# EAGLE board ws2812b-board (EAGLE 6.5.0), part 1 of 2
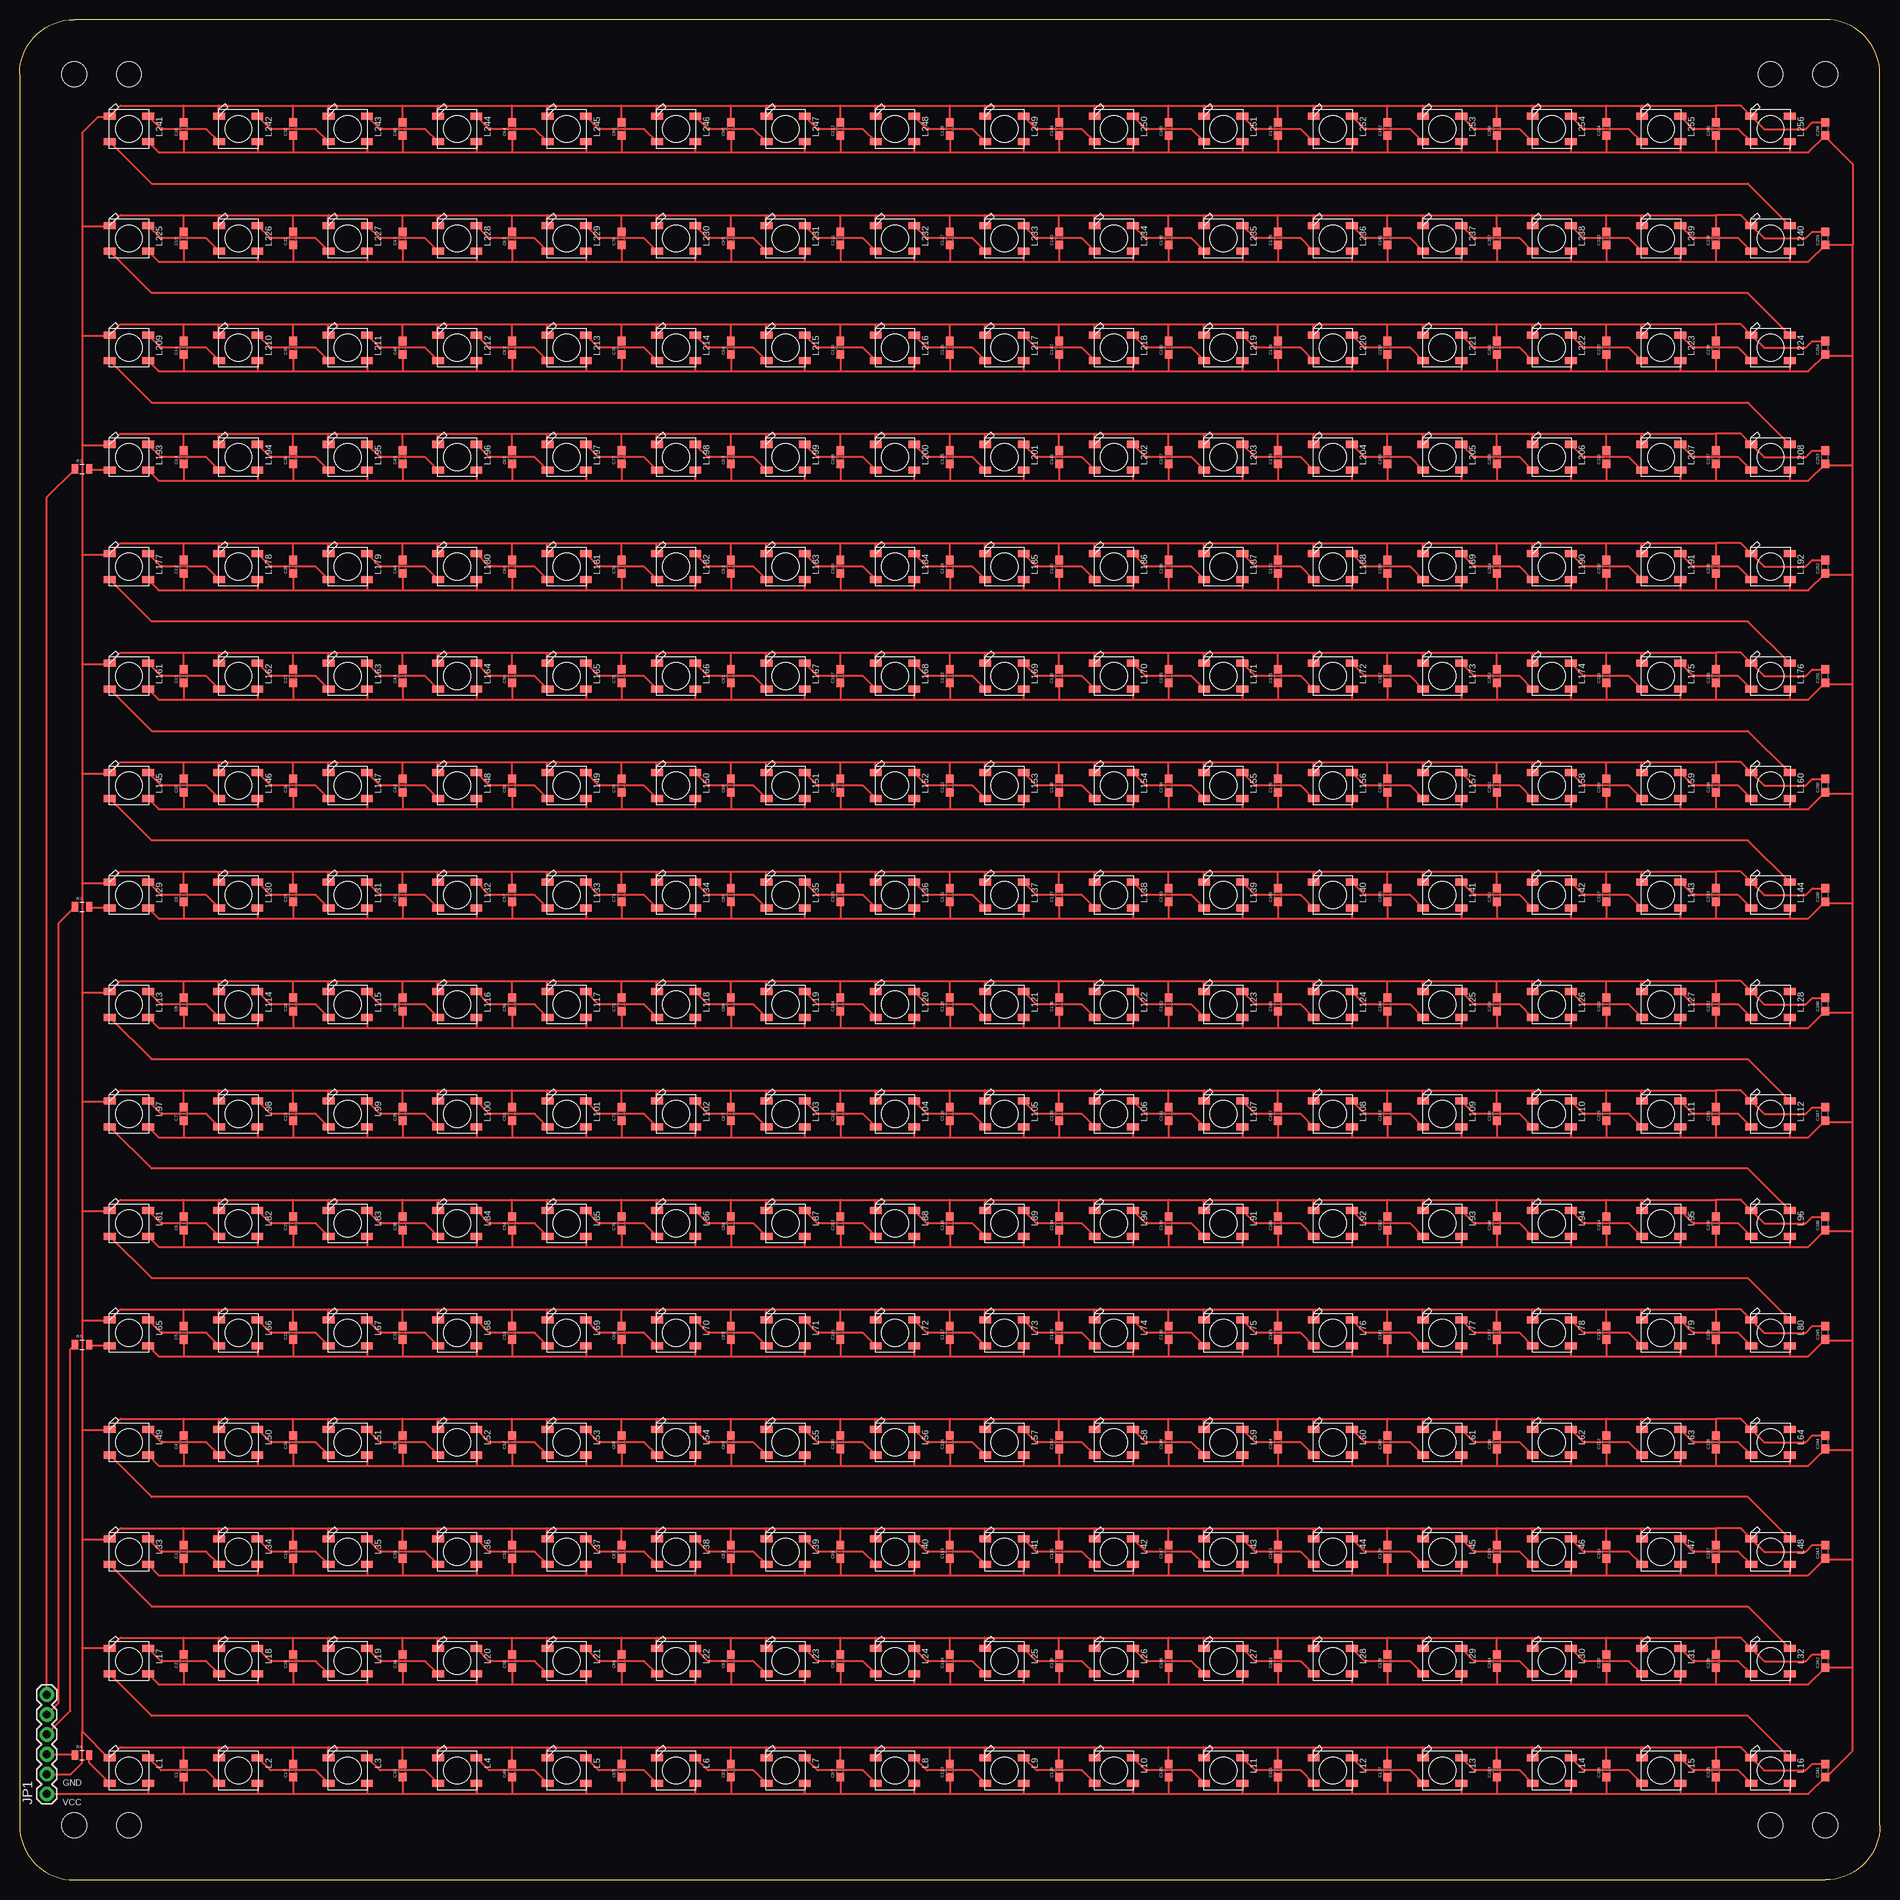
[diagram p2: board, top side]

Size 238 x 238 mm. Coordinates in mm from the lower left corner, seen from the top.
Outline: 7,0 231,0 arc90 238,7 238,231 arc90 231,238 7,238 arc90 0,231 0,7 arc90 7,0
Copper layers (1*16): Top 0.035mm / dielectric 1.5mm / Bottom 0.035mm
Design rules "DFRobot_Eagle_Rule_v0.4": minimum track width 6mil, minimum drill 12mil, track to track 6mil, track to pad 6mil, pad to pad 6mil, via to via 6mil, smd to smd 0mil, copper to edge 10mil, drill to drill 10mil, minimum pad ring 12mil, minimum via ring 8mil, stop-mask expansion 2mil, vias tented up to drill 25mil, thermal gap 10mil
Holes 3.2 mm at 7,231 231,231 231,7 7,7 14,231 224,231 224,7 14,7

## Footprints (pad centres in the part's own frame; a part is rotated, then mirrored left to right if it is on the bottom)
0603-CAP = smd 1.1 x 1: 1 -0.85,0; 2 0.85,0
1X06 = drill 1.016 pad 1.88: 1 0,0; 2 2.54,0; 3 5.08,0; 4 7.62,0; 5 10.16,0; 6 12.7,0
WS2812B = smd 1.5 x 0.9: 1-VDD 2.45,-1.65; 2-DOUT 2.45,1.65; 3-GND -2.45,1.65; 4-DIN -2.45,-1.65
0805 = smd 0.8 x 1.2: 1 -0.9,0; 2 0.9,0

## Placement (x,y rotation side)
C1  0.1uF  [0603-CAP]  21,14 90 top
C2  0.1uF  [0603-CAP]  21,28 90 top
C3  0.1uF  [0603-CAP]  21,42 90 top
C4  0.1uF  [0603-CAP]  21,56 90 top
C5  0.1uF  [0603-CAP]  21,70 90 top
C6  0.1uF  [0603-CAP]  21,84 90 top
C7  0.1uF  [0603-CAP]  21,98 90 top
C8  0.1uF  [0603-CAP]  21,112 90 top
C9  0.1uF  [0603-CAP]  21,126 90 top
C10  0.1uF  [0603-CAP]  21,140 90 top
C11  0.1uF  [0603-CAP]  21,154 90 top
C12  0.1uF  [0603-CAP]  21,168 90 top
C13  0.1uF  [0603-CAP]  21,182 90 top
C14  0.1uF  [0603-CAP]  21,196 90 top
C15  0.1uF  [0603-CAP]  21,210 90 top
C16  0.1uF  [0603-CAP]  21,224 90 top
C17  0.1uF  [0603-CAP]  35,14 90 top
C18  0.1uF  [0603-CAP]  35,28 90 top
C19  0.1uF  [0603-CAP]  35,42 90 top
C20  0.1uF  [0603-CAP]  35,56 90 top
C21  0.1uF  [0603-CAP]  35,70 90 top
C22  0.1uF  [0603-CAP]  35,84 90 top
C23  0.1uF  [0603-CAP]  35,98 90 top
C24  0.1uF  [0603-CAP]  35,112 90 top
C25  0.1uF  [0603-CAP]  35,126 90 top
C26  0.1uF  [0603-CAP]  35,140 90 top
C27  0.1uF  [0603-CAP]  35,154 90 top
C28  0.1uF  [0603-CAP]  35,168 90 top
C29  0.1uF  [0603-CAP]  35,182 90 top
C30  0.1uF  [0603-CAP]  35,196 90 top
C31  0.1uF  [0603-CAP]  35,210 90 top
C32  0.1uF  [0603-CAP]  35,224 90 top
C33  0.1uF  [0603-CAP]  49,14 90 top
C34  0.1uF  [0603-CAP]  49,28 90 top
C35  0.1uF  [0603-CAP]  49,42 90 top
C36  0.1uF  [0603-CAP]  49,56 90 top
C37  0.1uF  [0603-CAP]  49,70 90 top
C38  0.1uF  [0603-CAP]  49,84 90 top
C39  0.1uF  [0603-CAP]  49,98 90 top
C40  0.1uF  [0603-CAP]  49,112 90 top
C41  0.1uF  [0603-CAP]  49,126 90 top
C42  0.1uF  [0603-CAP]  49,140 90 top
C43  0.1uF  [0603-CAP]  49,154 90 top
C44  0.1uF  [0603-CAP]  49,168 90 top
C45  0.1uF  [0603-CAP]  49,182 90 top
C46  0.1uF  [0603-CAP]  49,196 90 top
C47  0.1uF  [0603-CAP]  49,210 90 top
C48  0.1uF  [0603-CAP]  49,224 90 top
C49  0.1uF  [0603-CAP]  63,14 90 top
C50  0.1uF  [0603-CAP]  63,28 90 top
C51  0.1uF  [0603-CAP]  63,42 90 top
C52  0.1uF  [0603-CAP]  63,56 90 top
C53  0.1uF  [0603-CAP]  63,70 90 top
C54  0.1uF  [0603-CAP]  63,84 90 top
C55  0.1uF  [0603-CAP]  63,98 90 top
C56  0.1uF  [0603-CAP]  63,112 90 top
C57  0.1uF  [0603-CAP]  63,126 90 top
C58  0.1uF  [0603-CAP]  63,140 90 top
C59  0.1uF  [0603-CAP]  63,154 90 top
C60  0.1uF  [0603-CAP]  63,168 90 top
C61  0.1uF  [0603-CAP]  63,182 90 top
C62  0.1uF  [0603-CAP]  63,196 90 top
C63  0.1uF  [0603-CAP]  63,210 90 top
C64  0.1uF  [0603-CAP]  63,224 90 top
C65  0.1uF  [0603-CAP]  77,14 90 top
C66  0.1uF  [0603-CAP]  77,28 90 top
C67  0.1uF  [0603-CAP]  77,42 90 top
C68  0.1uF  [0603-CAP]  77,56 90 top
C69  0.1uF  [0603-CAP]  77,70 90 top
C70  0.1uF  [0603-CAP]  77,84 90 top
C71  0.1uF  [0603-CAP]  77,98 90 top
C72  0.1uF  [0603-CAP]  77,112 90 top
C73  0.1uF  [0603-CAP]  77,126 90 top
C74  0.1uF  [0603-CAP]  77,140 90 top
C75  0.1uF  [0603-CAP]  77,154 90 top
C76  0.1uF  [0603-CAP]  77,168 90 top
C77  0.1uF  [0603-CAP]  77,182 90 top
C78  0.1uF  [0603-CAP]  77,196 90 top
C79  0.1uF  [0603-CAP]  77,210 90 top
C80  0.1uF  [0603-CAP]  77,224 90 top
C81  0.1uF  [0603-CAP]  91,14 90 top
C82  0.1uF  [0603-CAP]  91,28 90 top
C83  0.1uF  [0603-CAP]  91,42 90 top
C84  0.1uF  [0603-CAP]  91,56 90 top
C85  0.1uF  [0603-CAP]  91,70 90 top
C86  0.1uF  [0603-CAP]  91,84 90 top
C87  0.1uF  [0603-CAP]  91,98 90 top
C88  0.1uF  [0603-CAP]  91,112 90 top
C89  0.1uF  [0603-CAP]  91,126 90 top
C90  0.1uF  [0603-CAP]  91,140 90 top
C91  0.1uF  [0603-CAP]  91,154 90 top
C92  0.1uF  [0603-CAP]  91,168 90 top
C93  0.1uF  [0603-CAP]  91,182 90 top
C94  0.1uF  [0603-CAP]  91,196 90 top
C95  0.1uF  [0603-CAP]  91,210 90 top
C96  0.1uF  [0603-CAP]  91,224 90 top
C97  0.1uF  [0603-CAP]  105,14 90 top
C98  0.1uF  [0603-CAP]  105,28 90 top
C99  0.1uF  [0603-CAP]  105,42 90 top
C100  0.1uF  [0603-CAP]  105,56 90 top
C101  0.1uF  [0603-CAP]  105,70 90 top
C102  0.1uF  [0603-CAP]  105,84 90 top
C103  0.1uF  [0603-CAP]  105,98 90 top
C104  0.1uF  [0603-CAP]  105,112 90 top
C105  0.1uF  [0603-CAP]  105,126 90 top
C106  0.1uF  [0603-CAP]  105,140 90 top
C107  0.1uF  [0603-CAP]  105,154 90 top
C108  0.1uF  [0603-CAP]  105,168 90 top
C109  0.1uF  [0603-CAP]  105,182 90 top
C110  0.1uF  [0603-CAP]  105,196 90 top
C111  0.1uF  [0603-CAP]  105,210 90 top
C112  0.1uF  [0603-CAP]  105,224 90 top
C113  0.1uF  [0603-CAP]  119,14 90 top
C114  0.1uF  [0603-CAP]  119,28 90 top
C115  0.1uF  [0603-CAP]  119,42 90 top
C116  0.1uF  [0603-CAP]  119,56 90 top
C117  0.1uF  [0603-CAP]  119,70 90 top
C118  0.1uF  [0603-CAP]  119,84 90 top
C119  0.1uF  [0603-CAP]  119,98 90 top
C120  0.1uF  [0603-CAP]  119,112 90 top
C121  0.1uF  [0603-CAP]  119,126 90 top
C122  0.1uF  [0603-CAP]  119,140 90 top
C123  0.1uF  [0603-CAP]  119,154 90 top
C124  0.1uF  [0603-CAP]  119,168 90 top
C125  0.1uF  [0603-CAP]  119,182 90 top
C126  0.1uF  [0603-CAP]  119,196 90 top
C127  0.1uF  [0603-CAP]  119,210 90 top
C128  0.1uF  [0603-CAP]  119,224 90 top
C129  0.1uF  [0603-CAP]  133,14 90 top
C130  0.1uF  [0603-CAP]  133,28 90 top
C131  0.1uF  [0603-CAP]  133,42 90 top
C132  0.1uF  [0603-CAP]  133,56 90 top
C133  0.1uF  [0603-CAP]  133,70 90 top
C134  0.1uF  [0603-CAP]  133,84 90 top
C135  0.1uF  [0603-CAP]  133,98 90 top
C136  0.1uF  [0603-CAP]  133,112 90 top
C137  0.1uF  [0603-CAP]  133,126 90 top
C138  0.1uF  [0603-CAP]  133,140 90 top
C139  0.1uF  [0603-CAP]  133,154 90 top
C140  0.1uF  [0603-CAP]  133,168 90 top
C141  0.1uF  [0603-CAP]  133,182 90 top
C142  0.1uF  [0603-CAP]  133,196 90 top
C143  0.1uF  [0603-CAP]  133,210 90 top
C144  0.1uF  [0603-CAP]  133,224 90 top
C145  0.1uF  [0603-CAP]  147,14 90 top
C146  0.1uF  [0603-CAP]  147,28 90 top
C147  0.1uF  [0603-CAP]  147,42 90 top
C148  0.1uF  [0603-CAP]  147,56 90 top
C149  0.1uF  [0603-CAP]  147,70 90 top
C150  0.1uF  [0603-CAP]  147,84 90 top
C151  0.1uF  [0603-CAP]  147,98 90 top
C152  0.1uF  [0603-CAP]  147,112 90 top
C153  0.1uF  [0603-CAP]  147,126 90 top
C154  0.1uF  [0603-CAP]  147,140 90 top
C155  0.1uF  [0603-CAP]  147,154 90 top
C156  0.1uF  [0603-CAP]  147,168 90 top
C157  0.1uF  [0603-CAP]  147,182 90 top
C158  0.1uF  [0603-CAP]  147,196 90 top
C159  0.1uF  [0603-CAP]  147,210 90 top
C160  0.1uF  [0603-CAP]  147,224 90 top
C161  0.1uF  [0603-CAP]  161,14 90 top
C162  0.1uF  [0603-CAP]  161,28 90 top
C163  0.1uF  [0603-CAP]  161,42 90 top
C164  0.1uF  [0603-CAP]  161,56 90 top
C165  0.1uF  [0603-CAP]  161,70 90 top
C166  0.1uF  [0603-CAP]  161,84 90 top
C167  0.1uF  [0603-CAP]  161,98 90 top
C168  0.1uF  [0603-CAP]  161,112 90 top
C169  0.1uF  [0603-CAP]  161,126 90 top
C170  0.1uF  [0603-CAP]  161,140 90 top
C171  0.1uF  [0603-CAP]  161,154 90 top
C172  0.1uF  [0603-CAP]  161,168 90 top
C173  0.1uF  [0603-CAP]  161,182 90 top
C174  0.1uF  [0603-CAP]  161,196 90 top
C175  0.1uF  [0603-CAP]  161,210 90 top
C176  0.1uF  [0603-CAP]  161,224 90 top
C177  0.1uF  [0603-CAP]  175,14 90 top
C178  0.1uF  [0603-CAP]  175,28 90 top
C179  0.1uF  [0603-CAP]  175,42 90 top
C180  0.1uF  [0603-CAP]  175,56 90 top
C181  0.1uF  [0603-CAP]  175,70 90 top
C182  0.1uF  [0603-CAP]  175,84 90 top
C183  0.1uF  [0603-CAP]  175,98 90 top
C184  0.1uF  [0603-CAP]  175,112 90 top
C185  0.1uF  [0603-CAP]  175,126 90 top
C186  0.1uF  [0603-CAP]  175,140 90 top
C187  0.1uF  [0603-CAP]  175,154 90 top
C188  0.1uF  [0603-CAP]  175,168 90 top
C189  0.1uF  [0603-CAP]  175,182 90 top
C190  0.1uF  [0603-CAP]  175,196 90 top
C191  0.1uF  [0603-CAP]  175,210 90 top
C192  0.1uF  [0603-CAP]  175,224 90 top
C193  0.1uF  [0603-CAP]  189,14 90 top
C194  0.1uF  [0603-CAP]  189,28 90 top
C195  0.1uF  [0603-CAP]  189,42 90 top
C196  0.1uF  [0603-CAP]  189,56 90 top
C197  0.1uF  [0603-CAP]  189,70 90 top
C198  0.1uF  [0603-CAP]  189,84 90 top
C199  0.1uF  [0603-CAP]  189,98 90 top
C200  0.1uF  [0603-CAP]  189,112 90 top
C201  0.1uF  [0603-CAP]  189,126 90 top
C202  0.1uF  [0603-CAP]  189,140 90 top
C203  0.1uF  [0603-CAP]  189,154 90 top
C204  0.1uF  [0603-CAP]  189,168 90 top
C205  0.1uF  [0603-CAP]  189,182 90 top
C206  0.1uF  [0603-CAP]  189,196 90 top
C207  0.1uF  [0603-CAP]  189,210 90 top
C208  0.1uF  [0603-CAP]  189,224 90 top
C209  0.1uF  [0603-CAP]  203,14 90 top
C210  0.1uF  [0603-CAP]  203,28 90 top
C211  0.1uF  [0603-CAP]  203,42 90 top
C212  0.1uF  [0603-CAP]  203,56 90 top
C213  0.1uF  [0603-CAP]  203,70 90 top
C214  0.1uF  [0603-CAP]  203,84 90 top
C215  0.1uF  [0603-CAP]  203,98 90 top
C216  0.1uF  [0603-CAP]  203,112 90 top
C217  0.1uF  [0603-CAP]  203,126 90 top
C218  0.1uF  [0603-CAP]  203,140 90 top
C219  0.1uF  [0603-CAP]  203,154 90 top
C220  0.1uF  [0603-CAP]  203,168 90 top
C221  0.1uF  [0603-CAP]  203,182 90 top
C222  0.1uF  [0603-CAP]  203,196 90 top
C223  0.1uF  [0603-CAP]  203,210 90 top
C224  0.1uF  [0603-CAP]  203,224 90 top
C225  0.1uF  [0603-CAP]  217,14 90 top
C226  0.1uF  [0603-CAP]  217,28 90 top
C227  0.1uF  [0603-CAP]  217,42 90 top
C228  0.1uF  [0603-CAP]  217,56 90 top
C229  0.1uF  [0603-CAP]  217,70 90 top
C230  0.1uF  [0603-CAP]  217,84 90 top
C231  0.1uF  [0603-CAP]  217,98 90 top
C232  0.1uF  [0603-CAP]  217,112 90 top
C233  0.1uF  [0603-CAP]  217,126 90 top
C234  0.1uF  [0603-CAP]  217,140 90 top
C235  0.1uF  [0603-CAP]  217,154 90 top
C236  0.1uF  [0603-CAP]  217,168 90 top
C237  0.1uF  [0603-CAP]  217,182 90 top
C238  0.1uF  [0603-CAP]  217,196 90 top
C239  0.1uF  [0603-CAP]  217,210 90 top
C240  0.1uF  [0603-CAP]  217,224 90 top
C241  0.1uF  [0603-CAP]  231,14 90 top
C242  0.1uF  [0603-CAP]  231,28 90 top
C243  0.1uF  [0603-CAP]  231,42 90 top
C244  0.1uF  [0603-CAP]  231,56 90 top
C245  0.1uF  [0603-CAP]  231,70 90 top
C246  0.1uF  [0603-CAP]  231,84 90 top
C247  0.1uF  [0603-CAP]  231,98 90 top
C248  0.1uF  [0603-CAP]  231,112 90 top
C249  0.1uF  [0603-CAP]  231,126 90 top
C250  0.1uF  [0603-CAP]  231,140 90 top
C251  0.1uF  [0603-CAP]  231,154 90 top
C252  0.1uF  [0603-CAP]  231,168 90 top
C253  0.1uF  [0603-CAP]  231,182 90 top
C254  0.1uF  [0603-CAP]  231,196 90 top
C255  0.1uF  [0603-CAP]  231,210 90 top
C256  0.1uF  [0603-CAP]  231,224 90 top
JP1  [1X06]  3.5,11 90 top
L1  WS2812B  [WS2812B]  14,14 0 top
L2  WS2812B  [WS2812B]  28,14 0 top
L3  WS2812B  [WS2812B]  42,14 0 top
L4  WS2812B  [WS2812B]  56,14 0 top
L5  WS2812B  [WS2812B]  70,14 0 top
L6  WS2812B  [WS2812B]  84,14 0 top
L7  WS2812B  [WS2812B]  98,14 0 top
L8  WS2812B  [WS2812B]  112,14 0 top
L9  WS2812B  [WS2812B]  126,14 0 top
L10  WS2812B  [WS2812B]  140,14 0 top
L11  WS2812B  [WS2812B]  154,14 0 top
L12  WS2812B  [WS2812B]  168,14 0 top
L13  WS2812B  [WS2812B]  182,14 0 top
L14  WS2812B  [WS2812B]  196,14 0 top
L15  WS2812B  [WS2812B]  210,14 0 top
L16  WS2812B  [WS2812B]  224,14 0 top
L17  WS2812B  [WS2812B]  14,28 0 top
L18  WS2812B  [WS2812B]  28,28 0 top
L19  WS2812B  [WS2812B]  42,28 0 top
L20  WS2812B  [WS2812B]  56,28 0 top
L21  WS2812B  [WS2812B]  70,28 0 top
L22  WS2812B  [WS2812B]  84,28 0 top
L23  WS2812B  [WS2812B]  98,28 0 top
L24  WS2812B  [WS2812B]  112,28 0 top
L25  WS2812B  [WS2812B]  126,28 0 top
L26  WS2812B  [WS2812B]  140,28 0 top
L27  WS2812B  [WS2812B]  154,28 0 top
L28  WS2812B  [WS2812B]  168,28 0 top
L29  WS2812B  [WS2812B]  182,28 0 top
L30  WS2812B  [WS2812B]  196,28 0 top
L31  WS2812B  [WS2812B]  210,28 0 top
L32  WS2812B  [WS2812B]  224,28 0 top
L33  WS2812B  [WS2812B]  14,42 0 top
L34  WS2812B  [WS2812B]  28,42 0 top
L35  WS2812B  [WS2812B]  42,42 0 top
L36  WS2812B  [WS2812B]  56,42 0 top
L37  WS2812B  [WS2812B]  70,42 0 top
L38  WS2812B  [WS2812B]  84,42 0 top
L39  WS2812B  [WS2812B]  98,42 0 top
L40  WS2812B  [WS2812B]  112,42 0 top
L41  WS2812B  [WS2812B]  126,42 0 top
L42  WS2812B  [WS2812B]  140,42 0 top
L43  WS2812B  [WS2812B]  154,42 0 top
L44  WS2812B  [WS2812B]  168,42 0 top
L45  WS2812B  [WS2812B]  182,42 0 top
L46  WS2812B  [WS2812B]  196,42 0 top
L47  WS2812B  [WS2812B]  210,42 0 top
L48  WS2812B  [WS2812B]  224,42 0 top
L49  WS2812B  [WS2812B]  14,56 0 top
L50  WS2812B  [WS2812B]  28,56 0 top
L51  WS2812B  [WS2812B]  42,56 0 top
L52  WS2812B  [WS2812B]  56,56 0 top
L53  WS2812B  [WS2812B]  70,56 0 top
L54  WS2812B  [WS2812B]  84,56 0 top
L55  WS2812B  [WS2812B]  98,56 0 top
L56  WS2812B  [WS2812B]  112,56 0 top
L57  WS2812B  [WS2812B]  126,56 0 top
L58  WS2812B  [WS2812B]  140,56 0 top
L59  WS2812B  [WS2812B]  154,56 0 top
L60  WS2812B  [WS2812B]  168,56 0 top
L61  WS2812B  [WS2812B]  182,56 0 top
L62  WS2812B  [WS2812B]  196,56 0 top
L63  WS2812B  [WS2812B]  210,56 0 top
L64  WS2812B  [WS2812B]  224,56 0 top
L65  WS2812B  [WS2812B]  14,70 0 top
L66  WS2812B  [WS2812B]  28,70 0 top
L67  WS2812B  [WS2812B]  42,70 0 top
L68  WS2812B  [WS2812B]  56,70 0 top
L69  WS2812B  [WS2812B]  70,70 0 top
L70  WS2812B  [WS2812B]  84,70 0 top
L71  WS2812B  [WS2812B]  98,70 0 top
L72  WS2812B  [WS2812B]  112,70 0 top
L73  WS2812B  [WS2812B]  126,70 0 top
L74  WS2812B  [WS2812B]  140,70 0 top
L75  WS2812B  [WS2812B]  154,70 0 top
L76  WS2812B  [WS2812B]  168,70 0 top
L77  WS2812B  [WS2812B]  182,70 0 top
L78  WS2812B  [WS2812B]  196,70 0 top
L79  WS2812B  [WS2812B]  210,70 0 top
L80  WS2812B  [WS2812B]  224,70 0 top
L81  WS2812B  [WS2812B]  14,84 0 top
L82  WS2812B  [WS2812B]  28,84 0 top
L83  WS2812B  [WS2812B]  42,84 0 top
L84  WS2812B  [WS2812B]  56,84 0 top
L85  WS2812B  [WS2812B]  70,84 0 top
L86  WS2812B  [WS2812B]  84,84 0 top
L87  WS2812B  [WS2812B]  98,84 0 top
L88  WS2812B  [WS2812B]  112,84 0 top
L89  WS2812B  [WS2812B]  126,84 0 top
L90  WS2812B  [WS2812B]  140,84 0 top
L91  WS2812B  [WS2812B]  154,84 0 top
L92  WS2812B  [WS2812B]  168,84 0 top
L93  WS2812B  [WS2812B]  182,84 0 top
L94  WS2812B  [WS2812B]  196,84 0 top
L95  WS2812B  [WS2812B]  210,84 0 top
L96  WS2812B  [WS2812B]  224,84 0 top
L97  WS2812B  [WS2812B]  14,98 0 top
L98  WS2812B  [WS2812B]  28,98 0 top
L99  WS2812B  [WS2812B]  42,98 0 top
L100  WS2812B  [WS2812B]  56,98 0 top
L101  WS2812B  [WS2812B]  70,98 0 top
L102  WS2812B  [WS2812B]  84,98 0 top
L103  WS2812B  [WS2812B]  98,98 0 top
L104  WS2812B  [WS2812B]  112,98 0 top
L105  WS2812B  [WS2812B]  126,98 0 top
L106  WS2812B  [WS2812B]  140,98 0 top
L107  WS2812B  [WS2812B]  154,98 0 top
L108  WS2812B  [WS2812B]  168,98 0 top
L109  WS2812B  [WS2812B]  182,98 0 top
L110  WS2812B  [WS2812B]  196,98 0 top
L111  WS2812B  [WS2812B]  210,98 0 top
L112  WS2812B  [WS2812B]  224,98 0 top
L113  WS2812B  [WS2812B]  14,112 0 top
L114  WS2812B  [WS2812B]  28,112 0 top
L115  WS2812B  [WS2812B]  42,112 0 top
L116  WS2812B  [WS2812B]  56,112 0 top
L117  WS2812B  [WS2812B]  70,112 0 top
L118  WS2812B  [WS2812B]  84,112 0 top
L119  WS2812B  [WS2812B]  98,112 0 top
L120  WS2812B  [WS2812B]  112,112 0 top
L121  WS2812B  [WS2812B]  126,112 0 top
L122  WS2812B  [WS2812B]  140,112 0 top
L123  WS2812B  [WS2812B]  154,112 0 top
L124  WS2812B  [WS2812B]  168,112 0 top
L125  WS2812B  [WS2812B]  182,112 0 top
L126  WS2812B  [WS2812B]  196,112 0 top
L127  WS2812B  [WS2812B]  210,112 0 top
L128  WS2812B  [WS2812B]  224,112 0 top
L129  WS2812B  [WS2812B]  14,126 0 top
L130  WS2812B  [WS2812B]  28,126 0 top
L131  WS2812B  [WS2812B]  42,126 0 top
L132  WS2812B  [WS2812B]  56,126 0 top
L133  WS2812B  [WS2812B]  70,126 0 top
L134  WS2812B  [WS2812B]  84,126 0 top
L135  WS2812B  [WS2812B]  98,126 0 top
L136  WS2812B  [WS2812B]  112,126 0 top
L137  WS2812B  [WS2812B]  126,126 0 top
L138  WS2812B  [WS2812B]  140,126 0 top
L139  WS2812B  [WS2812B]  154,126 0 top
L140  WS2812B  [WS2812B]  168,126 0 top
L141  WS2812B  [WS2812B]  182,126 0 top
L142  WS2812B  [WS2812B]  196,126 0 top
L143  WS2812B  [WS2812B]  210,126 0 top
L144  WS2812B  [WS2812B]  224,126 0 top
L145  WS2812B  [WS2812B]  14,140 0 top
L146  WS2812B  [WS2812B]  28,140 0 top
L147  WS2812B  [WS2812B]  42,140 0 top
L148  WS2812B  [WS2812B]  56,140 0 top
L149  WS2812B  [WS2812B]  70,140 0 top
L150  WS2812B  [WS2812B]  84,140 0 top
L151  WS2812B  [WS2812B]  98,140 0 top
L152  WS2812B  [WS2812B]  112,140 0 top
L153  WS2812B  [WS2812B]  126,140 0 top
L154  WS2812B  [WS2812B]  140,140 0 top
L155  WS2812B  [WS2812B]  154,140 0 top
L156  WS2812B  [WS2812B]  168,140 0 top
L157  WS2812B  [WS2812B]  182,140 0 top
L158  WS2812B  [WS2812B]  196,140 0 top
L159  WS2812B  [WS2812B]  210,140 0 top
L160  WS2812B  [WS2812B]  224,140 0 top
L161  WS2812B  [WS2812B]  14,154 0 top
L162  WS2812B  [WS2812B]  28,154 0 top
L163  WS2812B  [WS2812B]  42,154 0 top
L164  WS2812B  [WS2812B]  56,154 0 top
L165  WS2812B  [WS2812B]  70,154 0 top
L166  WS2812B  [WS2812B]  84,154 0 top
L167  WS2812B  [WS2812B]  98,154 0 top
L168  WS2812B  [WS2812B]  112,154 0 top
L169  WS2812B  [WS2812B]  126,154 0 top
L170  WS2812B  [WS2812B]  140,154 0 top
L171  WS2812B  [WS2812B]  154,154 0 top
L172  WS2812B  [WS2812B]  168,154 0 top
L173  WS2812B  [WS2812B]  182,154 0 top
L174  WS2812B  [WS2812B]  196,154 0 top
L175  WS2812B  [WS2812B]  210,154 0 top
L176  WS2812B  [WS2812B]  224,154 0 top
L177  WS2812B  [WS2812B]  14,168 0 top
L178  WS2812B  [WS2812B]  28,168 0 top
L179  WS2812B  [WS2812B]  42,168 0 top
L180  WS2812B  [WS2812B]  56,168 0 top
L181  WS2812B  [WS2812B]  70,168 0 top
L182  WS2812B  [WS2812B]  84,168 0 top
L183  WS2812B  [WS2812B]  98,168 0 top
L184  WS2812B  [WS2812B]  112,168 0 top
L185  WS2812B  [WS2812B]  126,168 0 top
L186  WS2812B  [WS2812B]  140,168 0 top
L187  WS2812B  [WS2812B]  154,168 0 top
L188  WS2812B  [WS2812B]  168,168 0 top
L189  WS2812B  [WS2812B]  182,168 0 top
L190  WS2812B  [WS2812B]  196,168 0 top
L191  WS2812B  [WS2812B]  210,168 0 top
L192  WS2812B  [WS2812B]  224,168 0 top
L193  WS2812B  [WS2812B]  14,182 0 top
L194  WS2812B  [WS2812B]  28,182 0 top
L195  WS2812B  [WS2812B]  42,182 0 top
L196  WS2812B  [WS2812B]  56,182 0 top
L197  WS2812B  [WS2812B]  70,182 0 top
L198  WS2812B  [WS2812B]  84,182 0 top
L199  WS2812B  [WS2812B]  98,182 0 top
L200  WS2812B  [WS2812B]  112,182 0 top
L201  WS2812B  [WS2812B]  126,182 0 top
L202  WS2812B  [WS2812B]  140,182 0 top
L203  WS2812B  [WS2812B]  154,182 0 top
L204  WS2812B  [WS2812B]  168,182 0 top
L205  WS2812B  [WS2812B]  182,182 0 top
L206  WS2812B  [WS2812B]  196,182 0 top
L207  WS2812B  [WS2812B]  210,182 0 top
L208  WS2812B  [WS2812B]  224,182 0 top
L209  WS2812B  [WS2812B]  14,196 0 top
L210  WS2812B  [WS2812B]  28,196 0 top
L211  WS2812B  [WS2812B]  42,196 0 top
L212  WS2812B  [WS2812B]  56,196 0 top
L213  WS2812B  [WS2812B]  70,196 0 top
L214  WS2812B  [WS2812B]  84,196 0 top
L215  WS2812B  [WS2812B]  98,196 0 top
L216  WS2812B  [WS2812B]  112,196 0 top
L217  WS2812B  [WS2812B]  126,196 0 top
L218  WS2812B  [WS2812B]  140,196 0 top
L219  WS2812B  [WS2812B]  154,196 0 top
L220  WS2812B  [WS2812B]  168,196 0 top
L221  WS2812B  [WS2812B]  182,196 0 top
L222  WS2812B  [WS2812B]  196,196 0 top
L223  WS2812B  [WS2812B]  210,196 0 top
L224  WS2812B  [WS2812B]  224,196 0 top
L225  WS2812B  [WS2812B]  14,210 0 top
L226  WS2812B  [WS2812B]  28,210 0 top
L227  WS2812B  [WS2812B]  42,210 0 top
L228  WS2812B  [WS2812B]  56,210 0 top
L229  WS2812B  [WS2812B]  70,210 0 top
L230  WS2812B  [WS2812B]  84,210 0 top
L231  WS2812B  [WS2812B]  98,210 0 top
L232  WS2812B  [WS2812B]  112,210 0 top
L233  WS2812B  [WS2812B]  126,210 0 top
L234  WS2812B  [WS2812B]  140,210 0 top
L235  WS2812B  [WS2812B]  154,210 0 top
L236  WS2812B  [WS2812B]  168,210 0 top
L237  WS2812B  [WS2812B]  182,210 0 top
L238  WS2812B  [WS2812B]  196,210 0 top
L239  WS2812B  [WS2812B]  210,210 0 top
L240  WS2812B  [WS2812B]  224,210 0 top
L241  WS2812B  [WS2812B]  14,224 0 top
L242  WS2812B  [WS2812B]  28,224 0 top
L243  WS2812B  [WS2812B]  42,224 0 top
L244  WS2812B  [WS2812B]  56,224 0 top
L245  WS2812B  [WS2812B]  70,224 0 top
L246  WS2812B  [WS2812B]  84,224 0 top
L247  WS2812B  [WS2812B]  98,224 0 top
L248  WS2812B  [WS2812B]  112,224 0 top
L249  WS2812B  [WS2812B]  126,224 0 top
L250  WS2812B  [WS2812B]  140,224 0 top
L251  WS2812B  [WS2812B]  154,224 0 top
L252  WS2812B  [WS2812B]  168,224 0 top
L253  WS2812B  [WS2812B]  182,224 0 top
L254  WS2812B  [WS2812B]  196,224 0 top
L255  WS2812B  [WS2812B]  210,224 0 top
L256  WS2812B  [WS2812B]  224,224 0 top
R2  [0805]  8,180.5 0 top
R3  [0805]  8,124.5 0 top
R4  [0805]  8,16 0 top
R5  [0805]  8,68.5 0 top

## Tracks (layer width: path | path; a pad name or v marks a point on that pad's centre or on a via)
GND
  Top 0.254: 11.95,16.05 L1.3-GND 11.55,15.45 | 11.95,16.05 12.9,17 21,17 | L81.3-GND 11.95,86.05 | 11.95,86.05 12.9,87 21,87 | L129.3-GND 11.95,128.05 | 11.95,128.05 12.9,129 21,129 | 21,31 12.9,31 L17.3-GND 8,29.65 | 21,45 12.9,45 L33.3-GND 11.5,43.65 11.5,43.5 8,43.5 | 21,59 12.9,59 L49.3-GND 11.5,57.65 11.5,57.5 8,57.5 | 21,73 12.9,73 L65.3-GND 11.5,71.65 11.5,71.5 8,71.5 | 21,101 12.9,101 L97.3-GND 11.5,99.65 11.5,99.5 8,99.5 | 21,115 12.9,115 L113.3-GND 11.5,113.65 11.5,113.5 8,113.5 | 21,143 12.9,143 L145.3-GND 11.5,141.65 11.5,141.5 8,141.5 | 21,157 12.9,157 L161.3-GND 11.5,155.65 11.5,155.5 8,155.5 | 21,171 12.9,171 L177.3-GND 11.5,169.65 11.5,169.5 8,169.5 | 21,185 12.9,185 L193.3-GND 11.5,183.65 11.5,183.5 8,183.5 | 21,199 12.9,199 L209.3-GND 11.5,197.65 11.5,197.5 8,197.5 | 21,213 12.9,213 L225.3-GND 11.5,211.65 11.5,211.5 8,211.5 | 21,227 12.9,227 L241.3-GND 11.5,225.65 11.5,225.5 10,225.5 8,223.5 8,211.5 | 21,17 25.5,17 | 21,31 25.5,31 | 21,45 25.5,45 | 21,59 25.5,59 | 21,73 25.5,73 | 21,87 25.5,87 | 21,101 25.5,101 | 21,115 25.5,115 | 21,129 25.5,129 | 21,143 25.5,143 | 21,157 25.5,157 | 21,171 25.5,171 | 21,185 25.5,185 | 21,199 25.5,199 | 21,213 25.5,213 | 21,227 25.5,227 | 25.5,17 35,17 | 25.5,31 35,31 | 25.5,45 35,45 | 25.5,59 35,59 | 25.5,73 35,73 | 25.5,87 35,87 | 25.5,101 35,101 | 25.5,115 35,115 | 25.5,129 35,129 | 25.5,143 35,143 | 25.5,157 35,157 | 25.5,171 35,171 | 25.5,185 35,185 | 25.5,199 35,199 | 25.5,213 35,213 | 25.5,227 35,227 | 35,17 39.5,17 | 35,31 39.5,31 | 35,45 39.5,45 | 35,59 39.5,59 | 35,73 39.5,73 | 35,87 39.5,87 | 35,101 39.5,101 | 35,115 39.5,115 | 35,129 39.5,129 | 35,143 39.5,143 | 35,157 39.5,157 | 35,171 39.5,171 | 35,185 39.5,185
  Top 0.254: 35,199 39.5,199 | 35,213 39.5,213 | 35,227 39.5,227 | 39.5,17 49,17 | 39.5,31 49,31 | 39.5,45 49,45 | 39.5,59 49,59 | 39.5,73 49,73 | 39.5,87 49,87 | 39.5,101 49,101 | 39.5,115 49,115 | 39.5,129 49,129 | 39.5,143 49,143 | 39.5,157 49,157 | 39.5,171 49,171 | 39.5,185 49,185 | 39.5,199 49,199 | 39.5,213 49,213 | 39.5,227 49,227 | 49,17 53.5,17 | 49,31 53.5,31 | 49,45 53.5,45 | 49,59 53.5,59 | 49,73 53.5,73 | 49,87 53.5,87 | 49,101 53.5,101 | 49,115 53.5,115 | 49,129 53.5,129 | 49,143 53.5,143 | 49,157 53.5,157 | 49,171 53.5,171 | 49,185 53.5,185 | 49,199 53.5,199 | 49,213 53.5,213 | 49,227 53.5,227 | 53.5,17 63,17 | 53.5,31 63,31 | 53.5,45 63,45 | 53.5,59 63,59 | 53.5,73 63,73 | 53.5,87 63,87 | 53.5,101 63,101 | 53.5,115 63,115 | 53.5,129 63,129 | 53.5,143 63,143 | 53.5,157 63,157 | 53.5,171 63,171 | 53.5,185 63,185 | 53.5,199 63,199 | 53.5,213 63,213 | 53.5,227 63,227 | 63,17 67.5,17 | 63,31 67.5,31 | 63,45 67.5,45 | 63,59 67.5,59 | 63,73 67.5,73 | 63,87 67.5,87 | 63,101 67.5,101 | 63,115 67.5,115 | 63,129 67.5,129 | 63,143 67.5,143 | 63,157 67.5,157 | 63,171 67.5,171 | 63,185 67.5,185 | 63,199 67.5,199 | 63,213 67.5,213 | 63,227 67.5,227 | 67.5,17 77,17 | 67.5,31 77,31 | 67.5,45 77,45 | 67.5,59 77,59 | 67.5,73 77,73 | 67.5,87 77,87 | 67.5,101 77,101 | 67.5,115 77,115 | 67.5,129 77,129 | 67.5,143 77,143 | 67.5,157 77,157 | 67.5,171 77,171 | 67.5,185 77,185 | 67.5,199 77,199 | 67.5,213 77,213 | 67.5,227 77,227 | 77,17 81.5,17 | 77,31 81.5,31 | 77,45 81.5,45 | 77,59 81.5,59 | 77,73 81.5,73 | 77,87 81.5,87 | 77,101 81.5,101 | 77,115 81.5,115 | 77,129 81.5,129 | 77,143 81.5,143 | 77,157 81.5,157 | 77,171 81.5,171 | 77,185 81.5,185 | 77,199 81.5,199 | 77,213 81.5,213 | 77,227 81.5,227 | 81.5,17 91,17 | 81.5,31 91,31 | 81.5,45 91,45 | 81.5,59 91,59 | 81.5,73 91,73 | 81.5,87 91,87 | 81.5,101 91,101
  Top 0.254: 81.5,115 91,115 | 81.5,129 91,129 | 81.5,143 91,143 | 81.5,157 91,157 | 81.5,171 91,171 | 81.5,185 91,185 | 81.5,199 91,199 | 81.5,213 91,213 | 81.5,227 91,227 | 91,17 95.5,17 | 91,31 95.5,31 | 91,45 95.5,45 | 91,59 95.5,59 | 91,73 95.5,73 | 91,87 95.5,87 | 91,101 95.5,101 | 91,115 95.5,115 | 91,129 95.5,129 | 91,143 95.5,143 | 91,157 95.5,157 | 91,171 95.5,171 | 91,185 95.5,185 | 91,199 95.5,199 | 91,213 95.5,213 | 91,227 95.5,227 | 95.5,17 105,17 | 95.5,31 105,31 | 95.5,45 105,45 | 95.5,59 105,59 | 95.5,73 105,73 | 95.5,87 105,87 | 95.5,101 105,101 | 95.5,115 105,115 | 95.5,129 105,129 | 95.5,143 105,143 | 95.5,157 105,157 | 95.5,171 105,171 | 95.5,185 105,185 | 95.5,199 105,199 | 95.5,213 105,213 | 95.5,227 105,227 | 105,17 109.5,17 | 105,31 109.5,31 | 105,45 109.5,45 | 105,59 109.5,59 | 105,73 109.5,73 | 105,87 109.5,87 | 105,101 109.5,101 | 105,115 109.5,115 | 105,129 109.5,129 | 105,143 109.5,143 | 105,157 109.5,157 | 105,171 109.5,171 | 105,185 109.5,185 | 105,199 109.5,199 | 105,213 109.5,213 | 105,227 109.5,227 | 109.5,17 119,17 | 109.5,31 119,31 | 109.5,45 119,45 | 109.5,59 119,59 | 109.5,73 119,73 | 109.5,87 119,87 | 109.5,101 119,101 | 109.5,115 119,115 | 109.5,129 119,129 | 109.5,143 119,143 | 109.5,157 119,157 | 109.5,171 119,171 | 109.5,185 119,185 | 109.5,199 119,199 | 109.5,213 119,213 | 109.5,227 119,227 | 119,17 123.5,17 | 119,31 123.5,31 | 119,45 123.5,45 | 119,59 123.5,59 | 119,73 123.5,73 | 119,87 123.5,87 | 119,101 123.5,101 | 119,115 123.5,115 | 119,129 123.5,129 | 119,143 123.5,143 | 119,157 123.5,157 | 119,171 123.5,171 | 119,185 123.5,185 | 119,199 123.5,199 | 119,213 123.5,213 | 119,227 123.5,227 | 123.5,17 133,17 | 133,17 137.5,17 | 123.5,31 133,31 | 133,31 137.5,31 | 123.5,45 133,45 | 133,45 137.5,45 | 123.5,59 133,59 | 133,59 137.5,59
  Top 0.254: 123.5,73 133,73 | 133,73 137.5,73 | 123.5,87 133,87 | 133,87 137.5,87 | 123.5,101 133,101 | 133,101 137.5,101 | 123.5,115 133,115 | 133,115 137.5,115 | 123.5,129 133,129 | 133,129 137.5,129 | 123.5,143 133,143 | 133,143 137.5,143 | 123.5,157 133,157 | 133,157 137.5,157 | 123.5,171 133,171 | 133,171 137.5,171 | 123.5,185 133,185 | 133,185 137.5,185 | 123.5,199 133,199 | 133,199 137.5,199 | 123.5,213 133,213 | 133,213 137.5,213 | 123.5,227 133,227 | 133,227 137.5,227 | 137.5,17 147,17 | 137.5,31 147,31 | 137.5,45 147,45 | 137.5,59 147,59 | 137.5,73 147,73 | 137.5,87 147,87 | 137.5,101 147,101 | 137.5,115 147,115 | 137.5,129 147,129 | 137.5,143 147,143 | 137.5,157 147,157 | 137.5,171 147,171 | 137.5,185 147,185 | 137.5,199 147,199 | 137.5,213 147,213 | 137.5,227 147,227 | 147,17 151.5,17 | 147,31 151.5,31 | 147,45 151.5,45 | 147,59 151.5,59 | 147,73 151.5,73 | 147,87 151.5,87 | 147,101 151.5,101 | 147,115 151.5,115 | 147,129 151.5,129 | 147,143 151.5,143 | 147,157 151.5,157 | 147,171 151.5,171 | 147,185 151.5,185 | 147,199 151.5,199 | 147,213 151.5,213 | 147,227 151.5,227 | 151.5,17 161,17 | 151.5,31 161,31 | 151.5,45 161,45 | 151.5,59 161,59 | 151.5,73 161,73 | 151.5,87 161,87 | 151.5,101 161,101 | 151.5,115 161,115 | 151.5,129 161,129 | 151.5,143 161,143 | 151.5,157 161,157 | 151.5,171 161,171 | 151.5,185 161,185 | 151.5,199 161,199 | 151.5,213 161,213 | 151.5,227 161,227 | 161,17 165.5,17 | 161,31 165.5,31 | 161,45 165.5,45 | 161,59 165.5,59 | 161,73 165.5,73 | 161,87 165.5,87 | 161,101 165.5,101 | 161,115 165.5,115 | 161,129 165.5,129 | 161,143 165.5,143 | 161,157 165.5,157 | 161,171 165.5,171 | 161,185 165.5,185 | 161,199 165.5,199 | 161,213 165.5,213 | 161,227 165.5,227 | 165.5,17 175,17 | 165.5,31 175,31 | 165.5,45 175,45 | 165.5,59 175,59 | 165.5,73 175,73
  Top 0.254: 165.5,87 175,87 | 165.5,101 175,101 | 165.5,115 175,115 | 165.5,129 175,129 | 165.5,143 175,143 | 165.5,157 175,157 | 165.5,171 175,171 | 165.5,185 175,185 | 165.5,199 175,199 | 165.5,213 175,213 | 165.5,227 175,227 | 175,17 179.5,17 | 175,31 179.5,31 | 175,45 179.5,45 | 175,59 179.5,59 | 175,73 179.5,73 | 175,87 179.5,87 | 175,101 179.5,101 | 175,115 179.5,115 | 175,129 179.5,129 | 175,143 179.5,143 | 175,157 179.5,157 | 175,171 179.5,171 | 175,185 179.5,185 | 175,199 179.5,199 | 175,213 179.5,213 | 175,227 179.5,227 | 179.5,17 189,17 | 179.5,31 189,31 | 179.5,45 189,45 | 179.5,59 189,59 | 179.5,73 189,73 | 179.5,87 189,87 | 179.5,101 189,101 | 179.5,115 189,115 | 179.5,129 189,129 | 179.5,143 189,143 | 179.5,157 189,157 | 179.5,171 189,171 | 179.5,185 189,185 | 179.5,199 189,199 | 179.5,213 189,213 | 179.5,227 189,227 | 189,17 193.5,17 | 189,31 193.5,31 | 189,45 193.5,45 | 189,59 193.5,59 | 189,73 193.5,73 | 189,87 193.5,87 | 189,101 193.5,101 | 189,115 193.5,115 | 189,129 193.5,129 | 189,143 193.5,143 | 189,157 193.5,157 | 189,171 193.5,171 | 189,185 193.5,185 | 189,199 193.5,199 | 189,213 193.5,213 | 189,227 193.5,227 | 193.5,17 203,17 | 193.5,31 203,31 | 193.5,45 203,45 | 193.5,59 203,59 | 193.5,73 203,73 | 193.5,87 203,87 | 193.5,101 203,101 | 193.5,115 203,115 | 193.5,129 203,129 | 193.5,143 203,143 | 193.5,157 203,157 | 193.5,171 203,171 | 193.5,185 203,185 | 193.5,199 203,199 | 193.5,213 203,213 | 193.5,227 203,227 | 203,17 207.5,17 | 203,31 207.5,31 | 203,45 207.5,45 | 203,59 207.5,59 | 203,73 207.5,73 | 203,87 207.5,87 | 203,101 207.5,101 | 203,115 207.5,115 | 203,129 207.5,129 | 203,143 207.5,143 | 203,157 207.5,157 | 203,171 207.5,171 | 203,185 207.5,185 | 203,199 207.5,199 | 203,213 207.5,213 | 203,227 207.5,227 | 207.5,17 217,17 | 207.5,31 217,31
  Top 0.254: 207.5,45 217,45 | 207.5,59 217,59 | 207.5,73 217,73 | 207.5,87 217,87 | 207.5,101 217,101 | 207.5,115 217,115 | 207.5,129 217,129 | 207.5,143 217,143 | 207.5,157 217,157 | 207.5,171 217,171 | 207.5,185 217,185 | 207.5,199 217,199 | 207.5,213 217,213 | 207.5,227 217,227 | C1.2 21,17 | C2.2 21,31 | C3.2 21,45 | C4.2 21,59 | C5.2 21,73 | C6.2 21,87 | C7.2 21,101 | C8.2 21,115 | C9.2 21,129 | C10.2 21,143 | C11.2 21,157 | C12.2 21,171 | C13.2 21,185 | C14.2 21,199 | C15.2 21,213 | C16.2 21,227 | C17.2 35,17 | C18.2 35,31 | C19.2 35,45 | C20.2 35,59 | C21.2 35,73 | C22.2 35,87 | C23.2 35,101 | C24.2 35,115 | C25.2 35,129 | C26.2 35,143 | C27.2 35,157 | C28.2 35,171 | C29.2 35,185 | C30.2 35,199 | C31.2 35,213 | C32.2 35,227 | L3.3-GND 39.5,15.65 39.5,17 | L19.3-GND 39.5,29.65 39.5,31 | L35.3-GND 39.5,43.65 39.5,45 | L51.3-GND 39.5,57.65 39.5,59 | L67.3-GND 39.5,71.65 39.5,73 | L83.3-GND 39.5,85.65 39.5,87 | L99.3-GND 39.5,99.65 39.5,101 | L115.3-GND 39.5,113.65 39.5,115 | L131.3-GND 39.5,127.65 39.5,129 | L147.3-GND 39.5,141.65 39.5,143 | L163.3-GND 39.5,155.65 39.5,157 | L179.3-GND 39.5,169.65 39.5,171 | L195.3-GND 39.5,183.65 39.5,185 | L211.3-GND 39.5,197.65 39.5,199 | L227.3-GND 39.5,211.65 39.5,213 | L243.3-GND 39.5,225.65 39.5,227 | C33.2 49,17 | C34.2 49,31 | C35.2 49,45 | C36.2 49,59 | C37.2 49,73 | C38.2 49,87 | C39.2 49,101 | C40.2 49,115 | C41.2 49,129 | C42.2 49,143 | C43.2 49,157 | C44.2 49,171 | C45.2 49,185 | C46.2 49,199 | C47.2 49,213 | C48.2 49,227 | L4.3-GND 53.5,15.65 53.5,17 | L20.3-GND 53.5,29.65 53.5,31 | L36.3-GND 53.5,43.65 53.5,45 | L52.3-GND 53.5,57.65 53.5,59 | L68.3-GND 53.5,71.65 53.5,73 | L84.3-GND 53.5,85.65 53.5,87 | L100.3-GND 53.5,99.65 53.5,101 | L116.3-GND 53.5,113.65 53.5,115 | L132.3-GND 53.5,127.65 53.5,129
  Top 0.254: L148.3-GND 53.5,141.65 53.5,143 | L164.3-GND 53.5,155.65 53.5,157 | L180.3-GND 53.5,169.65 53.5,171 | L196.3-GND 53.5,183.65 53.5,185 | L212.3-GND 53.5,197.65 53.5,199 | L228.3-GND 53.5,211.65 53.5,213 | L244.3-GND 53.5,225.65 53.5,227 | C49.2 63,17 | C50.2 63,31 | C51.2 63,45 | C52.2 63,59 | C53.2 63,73 | C54.2 63,87 | C55.2 63,101 | C56.2 63,115 | C57.2 63,129 | C58.2 63,143 | C59.2 63,157 | C60.2 63,171 | C61.2 63,185 | C62.2 63,199 | C63.2 63,213 | C64.2 63,227 | L5.3-GND 67.5,15.65 67.5,17 | L21.3-GND 67.5,29.65 67.5,31 | L37.3-GND 67.5,43.65 67.5,45 | L53.3-GND 67.5,57.65 67.5,59 | L69.3-GND 67.5,71.65 67.5,73 | L85.3-GND 67.5,85.65 67.5,87 | L101.3-GND 67.5,99.65 67.5,101 | L117.3-GND 67.5,113.65 67.5,115 | L133.3-GND 67.5,127.65 67.5,129 | L149.3-GND 67.5,141.65 67.5,143 | L165.3-GND 67.5,155.65 67.5,157 | L181.3-GND 67.5,169.65 67.5,171 | L197.3-GND 67.5,183.65 67.5,185 | L213.3-GND 67.5,197.65 67.5,199 | L229.3-GND 67.5,211.65 67.5,213 | L245.3-GND 67.5,225.65 67.5,227 | C65.2 77,17 | C66.2 77,31 | C67.2 77,45 | C68.2 77,59 | C69.2 77,73 | C70.2 77,87 | C71.2 77,101 | C72.2 77,115 | C73.2 77,129 | C74.2 77,143 | C75.2 77,157 | C76.2 77,171 | C77.2 77,185 | C78.2 77,199 | C79.2 77,213 | C80.2 77,227 | L6.3-GND 81.5,15.65 81.5,17 | L22.3-GND 81.5,29.65 81.5,31 | L38.3-GND 81.5,43.65 81.5,45 | L54.3-GND 81.5,57.65 81.5,59 | L70.3-GND 81.5,71.65 81.5,73 | L86.3-GND 81.5,85.65 81.5,87 | L102.3-GND 81.5,99.65 81.5,101 | L118.3-GND 81.5,113.65 81.5,115 | L134.3-GND 81.5,127.65 81.5,129 | L150.3-GND 81.5,141.65 81.5,143 | L166.3-GND 81.5,155.65 81.5,157 | L182.3-GND 81.5,169.65 81.5,171 | L198.3-GND 81.5,183.65 81.5,185 | L214.3-GND 81.5,197.65 81.5,199 | L230.3-GND 81.5,211.65 81.5,213
  Top 0.254: L246.3-GND 81.5,225.65 81.5,227 | C81.2 91,17 | C82.2 91,31 | C83.2 91,45 | C84.2 91,59 | C85.2 91,73 | C86.2 91,87 | C87.2 91,101 | C88.2 91,115 | C89.2 91,129 | C90.2 91,143 | C91.2 91,157 | C92.2 91,171 | C93.2 91,185 | C94.2 91,199 | C95.2 91,213 | C96.2 91,227 | L7.3-GND 95.5,15.65 95.5,17 | L23.3-GND 95.5,29.65 95.5,31 | L39.3-GND 95.5,43.65 95.5,45 | L55.3-GND 95.5,57.65 95.5,59 | L71.3-GND 95.5,71.65 95.5,73 | L87.3-GND 95.5,85.65 95.5,87 | L103.3-GND 95.5,99.65 95.5,101 | L119.3-GND 95.5,113.65 95.5,115 | L135.3-GND 95.5,127.65 95.5,129 | L151.3-GND 95.5,141.65 95.5,143 | L167.3-GND 95.5,155.65 95.5,157 | L183.3-GND 95.5,169.65 95.5,171 | L199.3-GND 95.5,183.65 95.5,185 | L215.3-GND 95.5,197.65 95.5,199 | L231.3-GND 95.5,211.65 95.5,213 | L247.3-GND 95.5,225.65 95.5,227 | C97.2 105,17 | C98.2 105,31 | C99.2 105,45 | C100.2 105,59 | C101.2 105,73 | C102.2 105,87 | C103.2 105,101 | C104.2 105,115 | C105.2 105,129 | C106.2 105,143 | C107.2 105,157 | C108.2 105,171 | C109.2 105,185 | C110.2 105,199 | C111.2 105,213 | C112.2 105,227 | L8.3-GND 109.5,15.65 109.5,17 | L24.3-GND 109.5,29.65 109.5,31 | L40.3-GND 109.5,43.65 109.5,45 | L56.3-GND 109.5,57.65 109.5,59 | L72.3-GND 109.5,71.65 109.5,73 | L88.3-GND 109.5,85.65 109.5,87 | L104.3-GND 109.5,99.65 109.5,101 | L120.3-GND 109.5,113.65 109.5,115 | L136.3-GND 109.5,127.65 109.5,129 | L152.3-GND 109.5,141.65 109.5,143 | L168.3-GND 109.5,155.65 109.5,157 | L184.3-GND 109.5,169.65 109.5,171 | L200.3-GND 109.5,183.65 109.5,185 | L216.3-GND 109.5,197.65 109.5,199 | L232.3-GND 109.5,211.65 109.5,213 | L248.3-GND 109.5,225.65 109.5,227 | C113.2 119,17 | C114.2 119,31 | C115.2 119,45 | C116.2 119,59 | C117.2 119,73 | C118.2 119,87 | C119.2 119,101
  Top 0.254: C120.2 119,115 | C121.2 119,129 | C122.2 119,143 | C123.2 119,157 | C124.2 119,171 | C125.2 119,185 | C126.2 119,199 | C127.2 119,213 | C128.2 119,227 | L9.3-GND 123.5,15.65 123.5,17 | L25.3-GND 123.5,29.65 123.5,31 | L41.3-GND 123.5,43.65 123.5,45 | L57.3-GND 123.5,57.65 123.5,59 | L73.3-GND 123.5,71.65 123.5,73 | L89.3-GND 123.5,85.65 123.5,87 | L105.3-GND 123.5,99.65 123.5,101 | L121.3-GND 123.5,113.65 123.5,115 | L137.3-GND 123.5,127.65 123.5,129 | L153.3-GND 123.5,141.65 123.5,143 | L169.3-GND 123.5,155.65 123.5,157 | L185.3-GND 123.5,169.65 123.5,171 | L201.3-GND 123.5,183.65 123.5,185 | L217.3-GND 123.5,197.65 123.5,199 | L233.3-GND 123.5,211.65 123.5,213 | L249.3-GND 123.5,225.65 123.5,227 | L10.3-GND 137.5,15.65 137.5,17 | L26.3-GND 137.5,29.65 137.5,31 | L42.3-GND 137.5,43.65 137.5,45 | L58.3-GND 137.5,57.65 137.5,59 | L74.3-GND 137.5,71.65 137.5,73 | L90.3-GND 137.5,85.65 137.5,87 | L106.3-GND 137.5,99.65 137.5,101 | L122.3-GND 137.5,113.65 137.5,115 | L138.3-GND 137.5,127.65 137.5,129 | L154.3-GND 137.5,141.65 137.5,143 | L170.3-GND 137.5,155.65 137.5,157 | L186.3-GND 137.5,169.65 137.5,171 | L202.3-GND 137.5,183.65 137.5,185 | L218.3-GND 137.5,197.65 137.5,199 | L234.3-GND 137.5,211.65 137.5,213 | L250.3-GND 137.5,225.65 137.5,227 | C145.2 147,17 | C146.2 147,31 | C147.2 147,45 | C148.2 147,59 | C149.2 147,73 | C150.2 147,87 | C151.2 147,101 | C152.2 147,115 | C153.2 147,129 | C154.2 147,143 | C155.2 147,157 | C156.2 147,171 | C157.2 147,185 | C158.2 147,199 | C159.2 147,213 | C160.2 147,227 | L11.3-GND 151.5,15.65 151.5,17 | L27.3-GND 151.5,29.65 151.5,31 | L43.3-GND 151.5,43.65 151.5,45 | L59.3-GND 151.5,57.65 151.5,59 | L75.3-GND 151.5,71.65 151.5,73
  Top 0.254: L91.3-GND 151.5,85.65 151.5,87 | L107.3-GND 151.5,99.65 151.5,101 | L123.3-GND 151.5,113.65 151.5,115 | L139.3-GND 151.5,127.65 151.5,129 | L155.3-GND 151.5,141.65 151.5,143 | L171.3-GND 151.5,155.65 151.5,157 | L187.3-GND 151.5,169.65 151.5,171 | L203.3-GND 151.5,183.65 151.5,185 | L219.3-GND 151.5,197.65 151.5,199 | L235.3-GND 151.5,211.65 151.5,213 | L251.3-GND 151.5,225.65 151.5,227 | C161.2 161,17 | C162.2 161,31 | C163.2 161,45 | C164.2 161,59 | C165.2 161,73 | C166.2 161,87 | C167.2 161,101 | C168.2 161,115 | C169.2 161,129 | C170.2 161,143 | C171.2 161,157 | C172.2 161,171 | C173.2 161,185 | C174.2 161,199 | C175.2 161,213 | C176.2 161,227 | L12.3-GND 165.5,15.65 165.5,17 | L28.3-GND 165.5,29.65 165.5,31 | L44.3-GND 165.5,43.65 165.5,45 | L60.3-GND 165.5,57.65 165.5,59 | L76.3-GND 165.5,71.65 165.5,73 | L92.3-GND 165.5,85.65 165.5,87 | L108.3-GND 165.5,99.65 165.5,101 | L124.3-GND 165.5,113.65 165.5,115 | L140.3-GND 165.5,127.65 165.5,129 | L156.3-GND 165.5,141.65 165.5,143 | L172.3-GND 165.5,155.65 165.5,157 | L188.3-GND 165.5,169.65 165.5,171 | L204.3-GND 165.5,183.65 165.5,185 | L220.3-GND 165.5,197.65 165.5,199 | L236.3-GND 165.5,211.65 165.5,213 | L252.3-GND 165.5,225.65 165.5,227 | C177.2 175,17 | C178.2 175,31 | C179.2 175,45 | C180.2 175,59 | C181.2 175,73 | C182.2 175,87 | C183.2 175,101 | C184.2 175,115 | C185.2 175,129 | C186.2 175,143 | C187.2 175,157 | C188.2 175,171 | C189.2 175,185 | C190.2 175,199 | C191.2 175,213 | C192.2 175,227 | L13.3-GND 179.5,15.65 179.5,17 | L29.3-GND 179.5,29.65 179.5,31 | L45.3-GND 179.5,43.65 179.5,45 | L61.3-GND 179.5,57.65 179.5,59 | L77.3-GND 179.5,71.65 179.5,73 | L93.3-GND 179.5,85.65 179.5,87 | L109.3-GND 179.5,99.65 179.5,101
  Top 0.254: L125.3-GND 179.5,113.65 179.5,115 | L141.3-GND 179.5,127.65 179.5,129 | L157.3-GND 179.5,141.65 179.5,143 | L173.3-GND 179.5,155.65 179.5,157 | L189.3-GND 179.5,169.65 179.5,171 | L205.3-GND 179.5,183.65 179.5,185 | L221.3-GND 179.5,197.65 179.5,199 | L237.3-GND 179.5,211.65 179.5,213 | L253.3-GND 179.5,225.65 179.5,227 | C193.2 189,17 | C194.2 189,31 | C195.2 189,45 | C196.2 189,59 | C197.2 189,73 | C198.2 189,87 | C199.2 189,101 | C200.2 189,115 | C201.2 189,129 | C202.2 189,143 | C203.2 189,157 | C204.2 189,171 | C205.2 189,185 | C206.2 189,199 | C207.2 189,213 | C208.2 189,227 | L14.3-GND 193.5,15.65 193.5,17 | L30.3-GND 193.5,29.65 193.5,31 | L46.3-GND 193.5,43.65 193.5,45 | L62.3-GND 193.5,57.65 193.5,59 | L78.3-GND 193.5,71.65 193.5,73 | L94.3-GND 193.5,85.65 193.5,87 | L110.3-GND 193.5,99.65 193.5,101 | L126.3-GND 193.5,113.65 193.5,115 | L142.3-GND 193.5,127.65 193.5,129 | L158.3-GND 193.5,141.65 193.5,143 | L174.3-GND 193.5,155.65 193.5,157 | L190.3-GND 193.5,169.65 193.5,171 | L206.3-GND 193.5,183.65 193.5,185 | L222.3-GND 193.5,197.65 193.5,199 | L238.3-GND 193.5,211.65 193.5,213 | L254.3-GND 193.5,225.65 193.5,227 | C209.2 203,17 | C210.2 203,31 | C211.2 203,45 | C212.2 203,59 | C213.2 203,73 | C214.2 203,87 | C215.2 203,101 | C216.2 203,115 | C217.2 203,129 | C218.2 203,143 | C219.2 203,157 | C220.2 203,171 | C221.2 203,185 | C222.2 203,199 | C223.2 203,213 | C224.2 203,227 | L15.3-GND 207.5,15.65 207.5,17 | L31.3-GND 207.5,29.65 207.5,31 | L47.3-GND 207.5,43.65 207.5,45 | L63.3-GND 207.5,57.65 207.5,59 | L79.3-GND 207.5,71.65 207.5,73 | L95.3-GND 207.5,85.65 207.5,87 | L111.3-GND 207.5,99.65 207.5,101 | L127.3-GND 207.5,113.65 207.5,115 | L143.3-GND 207.5,127.65 207.5,129
  Top 0.254: L159.3-GND 207.5,141.65 207.5,143 | L175.3-GND 207.5,155.65 207.5,157 | L191.3-GND 207.5,169.65 207.5,171 | L207.3-GND 207.5,183.65 207.5,185 | L223.3-GND 207.5,197.65 207.5,199 | L239.3-GND 207.5,211.65 207.5,213 | L255.3-GND 207.5,225.65 207.5,227 | 217,17 C225.2 | 217,31 C226.2 | 217,45 C227.2 | 217,59 C228.2 | 217,73 C229.2 | 217,87 C230.2 | 217,101 C231.2 | 217,115 C232.2 | 217,129 C233.2 | 217,143 C234.2 | 217,157 C235.2 | 217,171 C236.2 | 217,185 C237.2 | 217,199 C238.2 | 217,213 C239.2 | 217,227 C240.2 | 217,17 220.2,17 L16.3-GND 223.2,14 228.5,14 229.35,14.85 C241.2 | 217,31 220.2,31 L32.3-GND 223.2,28 228.5,28 229.35,28.85 C242.2 | 217,45 220.2,45 L48.3-GND 223.2,42 228.5,42 229.35,42.85 C243.2 | 217,59 220.2,59 L64.3-GND 223.2,56 228.5,56 229.35,56.85 C244.2 | 217,73 220.2,73 L80.3-GND 223.2,70 228.5,70 229.35,70.85 C245.2 | 217,87 220.2,87 L96.3-GND 223.2,84 228.5,84 229.35,84.85 C246.2 | 217,101 220.2,101 L112.3-GND 223.2,98 228.5,98 229.35,98.85 C247.2 | 217,115 220.2,115 L128.3-GND 223.2,112 228.5,112 229.35,112.85 C248.2 | 217,129 220.2,129 L144.3-GND 223.2,126 228.5,126 229.35,126.85 C249.2 | 217,143 220.2,143 L160.3-GND 223.2,140 228.5,140 229.35,140.85 C250.2 | 217,157 220.2,157 L176.3-GND 223.2,154 228.5,154 229.35,154.85 C251.2 | 217,171 220.2,171 L192.3-GND 223.2,168 228.5,168 229.35,168.85 C252.2 | 217,185 220.2,185 L208.3-GND 223.2,182 228.5,182 229.35,182.85 C253.2 | 217,199 220.2,199 L224.3-GND 223.2,196 228.5,196 229.35,196.85 C254.2 | 217,213 220.2,213 L240.3-GND 223.2,210 228.5,210 229.35,210.85 C255.2 | 217,227 220.2,227 L256.3-GND 223.2,224 228.5,224 229.35,224.85 C256.2
  Top 0.254: L2.3-GND 25.5,15.7 25.5,17 | L18.3-GND 25.5,29.7 25.5,31 | L34.3-GND 25.5,43.7 25.5,45 | L50.3-GND 25.5,57.7 25.5,59 | L66.3-GND 25.5,71.7 25.5,73 | L82.3-GND 25.5,85.7 25.5,87 | L98.3-GND 25.5,99.7 25.5,101 | L114.3-GND 25.5,113.7 25.5,115 | L130.3-GND 25.5,127.7 25.5,129 | L146.3-GND 25.5,141.7 25.5,143 | L162.3-GND 25.5,155.7 25.5,157 | L178.3-GND 25.5,169.7 25.5,171 | L194.3-GND 25.5,183.7 25.5,185 | L210.3-GND 25.5,197.7 25.5,199 | L226.3-GND 25.5,211.7 25.5,213 | L242.3-GND 25.5,225.7 25.5,227 | 8,211.5 8,197.5 | 8,197.5 8,183.5 | 8,183.5 8,169.5 | 8,169.5 8,155.5 | 8,155.5 8,141.5 | 8,141.5 8,127.5 | 8,127.5 8,113.5 | 8,113.5 8,99.5 | 8,99.5 8,85.5 | 8,85.5 8,71.5 | 8,71.5 8,57.5 | 8,57.5 8,43.5 | 8,43.5 8,29.65 | 8,29.65 8,19 | 8,19 11.5,15.5 11.95,15.5 11.95,16.05 | 8,85.5 11.95,85.5 11.95,86.05 | 8,127.5 11.95,127.5 11.95,128.05 | C129.2 133,17 | C130.2 133,31 | C131.2 133,45 | C132.2 133,59 | C133.2 133,73 | C134.2 133,87 | C135.2 133,101 | C136.2 133,115 | C137.2 133,129 | C138.2 133,143 | C139.2 133,157 | C141.2 133,185 | C142.2 133,199 | C143.2 133,213 | C144.2 133,227 | C140.2 133,171 | 8,19 8,15 6.54,13.54 JP1.2
N$1
  Top 0.254: L2.4-DIN 23.9,14 18.1,14 L1.2-DOUT
N$2
  Top 0.254: L3.4-DIN 37.9,14 32.1,14 L2.2-DOUT
N$3
  Top 0.254: L4.4-DIN 51.9,14 46.1,14 L3.2-DOUT
N$4
  Top 0.254: L5.4-DIN 65.9,14 60.1,14 L4.2-DOUT
N$5
  Top 0.254: L6.4-DIN 79.9,14 74.1,14 L5.2-DOUT
N$6
  Top 0.254: L7.4-DIN 93.9,14 88.1,14 L6.2-DOUT
N$7
  Top 0.254: L8.4-DIN 107.9,14 102.1,14 L7.2-DOUT
N$8
  Top 0.254: L9.4-DIN 121.9,14 116.1,14 L8.2-DOUT
N$9
  Top 0.254: L10.4-DIN 135.9,14 130.1,14 L9.2-DOUT
N$10
  Top 0.254: L11.4-DIN 149.9,14 144.1,14 L10.2-DOUT
N$11
  Top 0.254: L12.4-DIN 163.9,14 158.1,14 L11.2-DOUT
N$12
  Top 0.254: L13.4-DIN 177.9,14 172.1,14 L12.2-DOUT
N$13
  Top 0.254: L14.4-DIN 191.9,14 186.1,14 L13.2-DOUT
N$14
  Top 0.254: L15.4-DIN 205.9,14 200.1,14 L14.2-DOUT
N$15
  Top 0.254: L16.4-DIN 219.9,14 214.1,14 L15.2-DOUT
N$16
  Top 0.254: L16.2-DOUT 221.1,21 16.9,21 L17.4-DIN
N$17
  Top 0.254: L18.4-DIN 23.9,28 18.1,28 L17.2-DOUT
N$18
  Top 0.254: L19.4-DIN 37.9,28 32.1,28 L18.2-DOUT
N$19
  Top 0.254: L20.4-DIN 51.9,28 46.1,28 L19.2-DOUT
N$20
  Top 0.254: L21.4-DIN 65.9,28 60.1,28 L20.2-DOUT
N$21
  Top 0.254: L22.4-DIN 79.9,28 74.1,28 L21.2-DOUT
N$22
  Top 0.254: L23.4-DIN 93.9,28 88.1,28 L22.2-DOUT
N$23
  Top 0.254: L24.4-DIN 107.9,28 102.1,28 L23.2-DOUT
N$24
  Top 0.254: L25.4-DIN 121.9,28 116.1,28 L24.2-DOUT
N$25
  Top 0.254: L26.4-DIN 135.9,28 130.1,28 L25.2-DOUT
N$26
  Top 0.254: L27.4-DIN 149.9,28 144.1,28 L26.2-DOUT
N$27
  Top 0.254: L28.4-DIN 163.9,28 158.1,28 L27.2-DOUT
N$28
  Top 0.254: L29.4-DIN 177.9,28 172.1,28 L28.2-DOUT
N$29
  Top 0.254: L30.4-DIN 191.9,28 186.1,28 L29.2-DOUT
N$30
  Top 0.254: L31.4-DIN 205.9,28 200.1,28 L30.2-DOUT
N$31
  Top 0.254: L32.4-DIN 219.9,28 214.1,28 L31.2-DOUT
N$32
  Top 0.254: L33.4-DIN 16.9,35 221.1,35 L32.2-DOUT
N$33
  Top 0.254: L34.4-DIN 23.9,42 18.1,42 L33.2-DOUT
N$34
  Top 0.254: L35.4-DIN 37.9,42 32.1,42 L34.2-DOUT
N$35
  Top 0.254: L36.4-DIN 51.9,42 46.1,42 L35.2-DOUT
N$36
  Top 0.254: L37.4-DIN 65.9,42 60.1,42 L36.2-DOUT
N$37
  Top 0.254: L38.4-DIN 79.9,42 74.1,42 L37.2-DOUT
N$38
  Top 0.254: L39.4-DIN 93.9,42 88.1,42 L38.2-DOUT
N$39
  Top 0.254: L40.4-DIN 107.9,42 102.1,42 L39.2-DOUT
N$40
  Top 0.254: L41.4-DIN 121.9,42 116.1,42 L40.2-DOUT
N$41
  Top 0.254: L42.4-DIN 135.9,42 130.1,42 L41.2-DOUT
N$42
  Top 0.254: L43.4-DIN 149.9,42 144.1,42 L42.2-DOUT
N$43
  Top 0.254: L44.4-DIN 163.9,42 158.1,42 L43.2-DOUT
N$44
  Top 0.254: L45.4-DIN 177.9,42 172.1,42 L44.2-DOUT
N$45
  Top 0.254: L46.4-DIN 191.9,42 186.1,42 L45.2-DOUT
N$46
  Top 0.254: L47.4-DIN 205.9,42 200.1,42 L46.2-DOUT
N$47
  Top 0.254: L48.4-DIN 219.9,42 214.1,42 L47.2-DOUT
N$48
  Top 0.254: L48.2-DOUT 221.1,49 16.9,49 L49.4-DIN
N$49
  Top 0.254: L50.4-DIN 23.9,56 18.1,56 L49.2-DOUT
N$50
  Top 0.254: L51.4-DIN 37.9,56 32.1,56 L50.2-DOUT
N$51
  Top 0.254: L52.4-DIN 51.9,56 46.1,56 L51.2-DOUT
N$52
  Top 0.254: L53.4-DIN 65.9,56 60.1,56 L52.2-DOUT
N$53
  Top 0.254: L54.4-DIN 79.9,56 74.1,56 L53.2-DOUT
N$54
  Top 0.254: L55.4-DIN 93.9,56 88.1,56 L54.2-DOUT
N$55
  Top 0.254: L56.4-DIN 107.9,56 102.1,56 L55.2-DOUT
N$56
  Top 0.254: L57.4-DIN 121.9,56 116.1,56 L56.2-DOUT
N$57
  Top 0.254: L58.4-DIN 135.9,56 130.1,56 L57.2-DOUT
N$58
  Top 0.254: L59.4-DIN 149.9,56 144.1,56 L58.2-DOUT
N$59
  Top 0.254: L60.4-DIN 163.9,56 158.1,56 L59.2-DOUT
N$60
  Top 0.254: L61.4-DIN 177.9,56 172.1,56 L60.2-DOUT
N$61
  Top 0.254: L62.4-DIN 191.9,56 186.1,56 L61.2-DOUT
N$62
  Top 0.254: L63.4-DIN 205.9,56 200.1,56 L62.2-DOUT
N$63
  Top 0.254: L64.4-DIN 219.9,56 214.1,56 L63.2-DOUT
N$64
  Top 0.254: L66.4-DIN 23.9,70 18.1,70 L65.2-DOUT
N$65
  Top 0.254: L67.4-DIN 37.9,70 32.1,70 L66.2-DOUT
N$66
  Top 0.254: L68.4-DIN 51.9,70 46.1,70 L67.2-DOUT
N$67
  Top 0.254: L69.4-DIN 65.9,70 60.1,70 L68.2-DOUT
N$68
  Top 0.254: L70.4-DIN 79.9,70 74.1,70 L69.2-DOUT
N$69
  Top 0.254: L71.4-DIN 93.9,70 88.1,70 L70.2-DOUT
N$70
  Top 0.254: L72.4-DIN 107.9,70 102.1,70 L71.2-DOUT
N$71
  Top 0.254: L73.4-DIN 121.9,70 116.1,70 L72.2-DOUT
N$72
  Top 0.254: L74.4-DIN 135.9,70 130.1,70 L73.2-DOUT
N$73
  Top 0.254: L75.4-DIN 149.9,70 144.1,70 L74.2-DOUT
N$74
  Top 0.254: L76.4-DIN 163.9,70 158.1,70 L75.2-DOUT
N$75
  Top 0.254: L77.4-DIN 177.9,70 172.1,70 L76.2-DOUT
N$76
  Top 0.254: L78.4-DIN 191.9,70 186.1,70 L77.2-DOUT
N$77
  Top 0.254: L79.4-DIN 205.9,70 200.1,70 L78.2-DOUT
N$78
  Top 0.254: L80.4-DIN 219.9,70 214.1,70 L79.2-DOUT
N$79
  Top 0.254: L81.4-DIN 16.9,77 221.1,77 L80.2-DOUT
N$80
  Top 0.254: L82.4-DIN 23.9,84 18.1,84 L81.2-DOUT
N$81
  Top 0.254: L83.4-DIN 37.9,84 32.1,84 L82.2-DOUT
N$82
  Top 0.254: L84.4-DIN 51.9,84 46.1,84 L83.2-DOUT
N$83
  Top 0.254: L85.4-DIN 65.9,84 60.1,84 L84.2-DOUT
N$84
  Top 0.254: L86.4-DIN 79.9,84 74.1,84 L85.2-DOUT
N$85
  Top 0.254: L87.4-DIN 93.9,84 88.1,84 L86.2-DOUT
N$86
  Top 0.254: L88.4-DIN 107.9,84 102.1,84 L87.2-DOUT
N$87
  Top 0.254: L89.4-DIN 121.9,84 116.1,84 L88.2-DOUT
N$88
  Top 0.254: L90.4-DIN 135.9,84 130.1,84 L89.2-DOUT
N$89
  Top 0.254: L91.4-DIN 149.9,84 144.1,84 L90.2-DOUT
N$90
  Top 0.254: L92.4-DIN 163.9,84 158.1,84 L91.2-DOUT
N$91
  Top 0.254: L93.4-DIN 177.9,84 172.1,84 L92.2-DOUT
N$92
  Top 0.254: L94.4-DIN 191.9,84 186.1,84 L93.2-DOUT
N$93
  Top 0.254: L95.4-DIN 205.9,84 200.1,84 L94.2-DOUT
N$94
  Top 0.254: L96.4-DIN 219.9,84 214.1,84 L95.2-DOUT
N$95
  Top 0.254: L96.2-DOUT 221.1,91 16.9,91 L97.4-DIN
N$96
  Top 0.254: L98.4-DIN 23.9,98 18.1,98 L97.2-DOUT
N$97
  Top 0.254: L99.4-DIN 37.9,98 32.1,98 L98.2-DOUT
N$98
  Top 0.254: L100.4-DIN 51.9,98 46.1,98 L99.2-DOUT
N$99
  Top 0.254: L101.4-DIN 65.9,98 60.1,98 L100.2-DOUT
N$100
  Top 0.254: L102.4-DIN 79.9,98 74.1,98 L101.2-DOUT
N$101
  Top 0.254: L103.4-DIN 93.9,98 88.1,98 L102.2-DOUT
N$102
  Top 0.254: L104.4-DIN 107.9,98 102.1,98 L103.2-DOUT
N$103
  Top 0.254: L105.4-DIN 121.9,98 116.1,98 L104.2-DOUT
N$104
  Top 0.254: L106.4-DIN 135.9,98 130.1,98 L105.2-DOUT
N$105
  Top 0.254: L107.4-DIN 149.9,98 144.1,98 L106.2-DOUT
N$106
  Top 0.254: L108.4-DIN 163.9,98 158.1,98 L107.2-DOUT
N$107
  Top 0.254: L109.4-DIN 177.9,98 172.1,98 L108.2-DOUT
N$108
  Top 0.254: L110.4-DIN 191.9,98 186.1,98 L109.2-DOUT
N$109
  Top 0.254: L111.4-DIN 205.9,98 200.1,98 L110.2-DOUT
N$110
  Top 0.254: L112.4-DIN 219.9,98 214.1,98 L111.2-DOUT
N$111
  Top 0.254: L113.4-DIN 16.9,105 221.1,105 L112.2-DOUT
N$112
  Top 0.254: L114.4-DIN 23.9,112 18.1,112 L113.2-DOUT
N$113